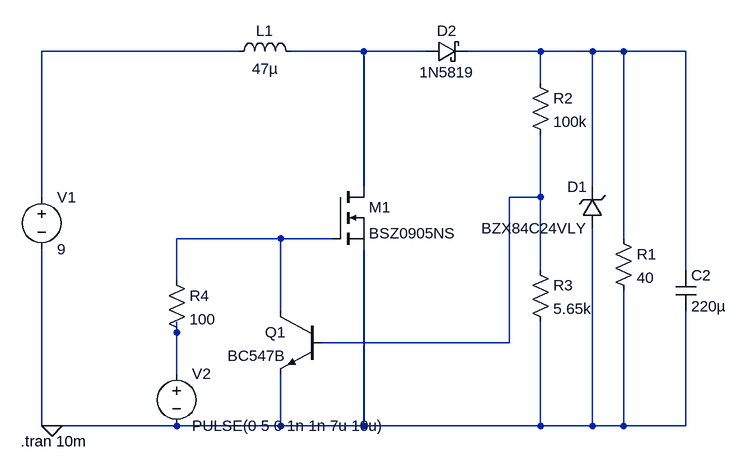
[diagram p0: schematic withfb.asc]
withfb.asc, the LTspice schematic file:
Version 4
SHEET 1 1320 680
WIRE 560 -80 256 -80
WIRE 752 -80 640 -80
WIRE 848 -80 752 -80
WIRE 1024 -80 912 -80
WIRE 1104 -80 1024 -80
WIRE 1152 -80 1104 -80
WIRE 1248 -80 1152 -80
WIRE 1024 -32 1024 -80
WIRE 752 128 752 -80
WIRE 1104 128 1104 -80
WIRE 256 144 256 -80
WIRE 1024 144 1024 48
WIRE 1024 144 976 144
WIRE 624 208 464 208
WIRE 704 208 624 208
WIRE 1152 208 1152 -80
WIRE 1024 256 1024 144
WIRE 1248 256 1248 -80
WIRE 464 272 464 208
WIRE 624 320 624 208
WIRE 464 352 464 336
WIRE 976 368 976 144
WIRE 976 368 688 368
WIRE 464 416 464 352
WIRE 256 496 256 224
WIRE 272 496 256 496
WIRE 464 496 272 496
WIRE 624 496 624 416
WIRE 624 496 464 496
WIRE 752 496 752 224
WIRE 752 496 624 496
WIRE 1024 496 1024 336
WIRE 1024 496 752 496
WIRE 1104 496 1104 192
WIRE 1104 496 1024 496
WIRE 1152 496 1152 288
WIRE 1152 496 1104 496
WIRE 1248 496 1248 320
WIRE 1248 496 1152 496
FLAG 272 496 0
SYMBOL nmos 704 128 R0
SYMATTR InstName M1
SYMATTR Value BSZ0905NS
SYMBOL ind 544 -64 R270
WINDOW 0 32 56 VTop 2
WINDOW 3 5 56 VBottom 2
SYMATTR InstName L1
SYMATTR Value 47µ
SYMATTR SpiceLine Rser=50m
SYMBOL schottky 848 -64 R270
WINDOW 0 32 32 VTop 2
WINDOW 3 0 32 VBottom 2
SYMATTR InstName D2
SYMATTR Value 1N5819
SYMATTR Description Diode
SYMATTR Type diode
SYMBOL cap 1232 256 R0
SYMATTR InstName C2
SYMATTR Value 220µ
SYMBOL voltage 256 128 R0
WINDOW 123 0 0 Left 0
WINDOW 39 0 0 Left 0
SYMATTR InstName V1
SYMATTR Value 9
SYMBOL voltage 464 400 R0
WINDOW 123 0 0 Left 0
WINDOW 39 0 0 Left 0
SYMATTR InstName V2
SYMATTR Value PULSE(0 5 0 1n 1n 7u 10u)
SYMBOL res 1136 192 R0
SYMATTR InstName R1
SYMATTR Value 40
SYMBOL npn 688 320 M0
SYMATTR InstName Q1
SYMATTR Value BC547B
SYMBOL res 1008 -48 R0
SYMATTR InstName R2
SYMATTR Value 100k
SYMBOL res 1008 240 R0
SYMATTR InstName R3
SYMATTR Value 5.65k
SYMBOL res 448 256 R0
SYMATTR InstName R4
SYMATTR Value 100
SYMBOL zener 1120 192 R180
WINDOW 0 24 64 Left 2
WINDOW 3 24 0 Left 2
SYMATTR InstName D1
SYMATTR Value BZX84C24VLY
SYMATTR Description Diode
SYMATTR Type diode
TEXT 224 520 Left 2 !.tran 10m

The netlist it stands for:
* withfb.asc
M1 N002 N005 0 0 BSZ0905NS
L1 N001 N002 47µ Rser=50m
D2 N002 N003 1N5819
C2 N003 0 220µ
V1 N001 0 9
V2 N006 0 PULSE(0 5 0 1n 1n 7u 10u)
R1 N003 0 40
Q1 N005 N004 0 0 BC547B
R2 N003 N004 100k
R3 N004 0 5.65k
R4 N005 N006 100
D1 0 N003 BZX84C24VLY
.model D D
.lib standard.dio
.model NPN NPN
.model PNP PNP
.lib standard.bjt
.model NMOS NMOS
.model PMOS PMOS
.lib standard.mos
.tran 10m
.backanno
.end